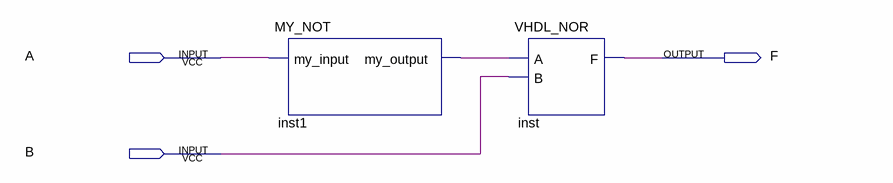
[diagram p0: schematic sheet]
// Quartus schematic MIXED.bdf as structural Verilog: 2 symbols, 3 pins
module MIXED (
  input  A,
  input  B,
  output F
);

  wire inst1_my_output;

  MY_NOT inst1 (.my_input(A), .my_output(inst1_my_output));
  VHDL_NOR inst (.A(inst1_my_output), .B(B), .F(F));
endmodule
